# EAGLE design Detect-frelon_TONE3-1 (EAGLE 9.6.2)
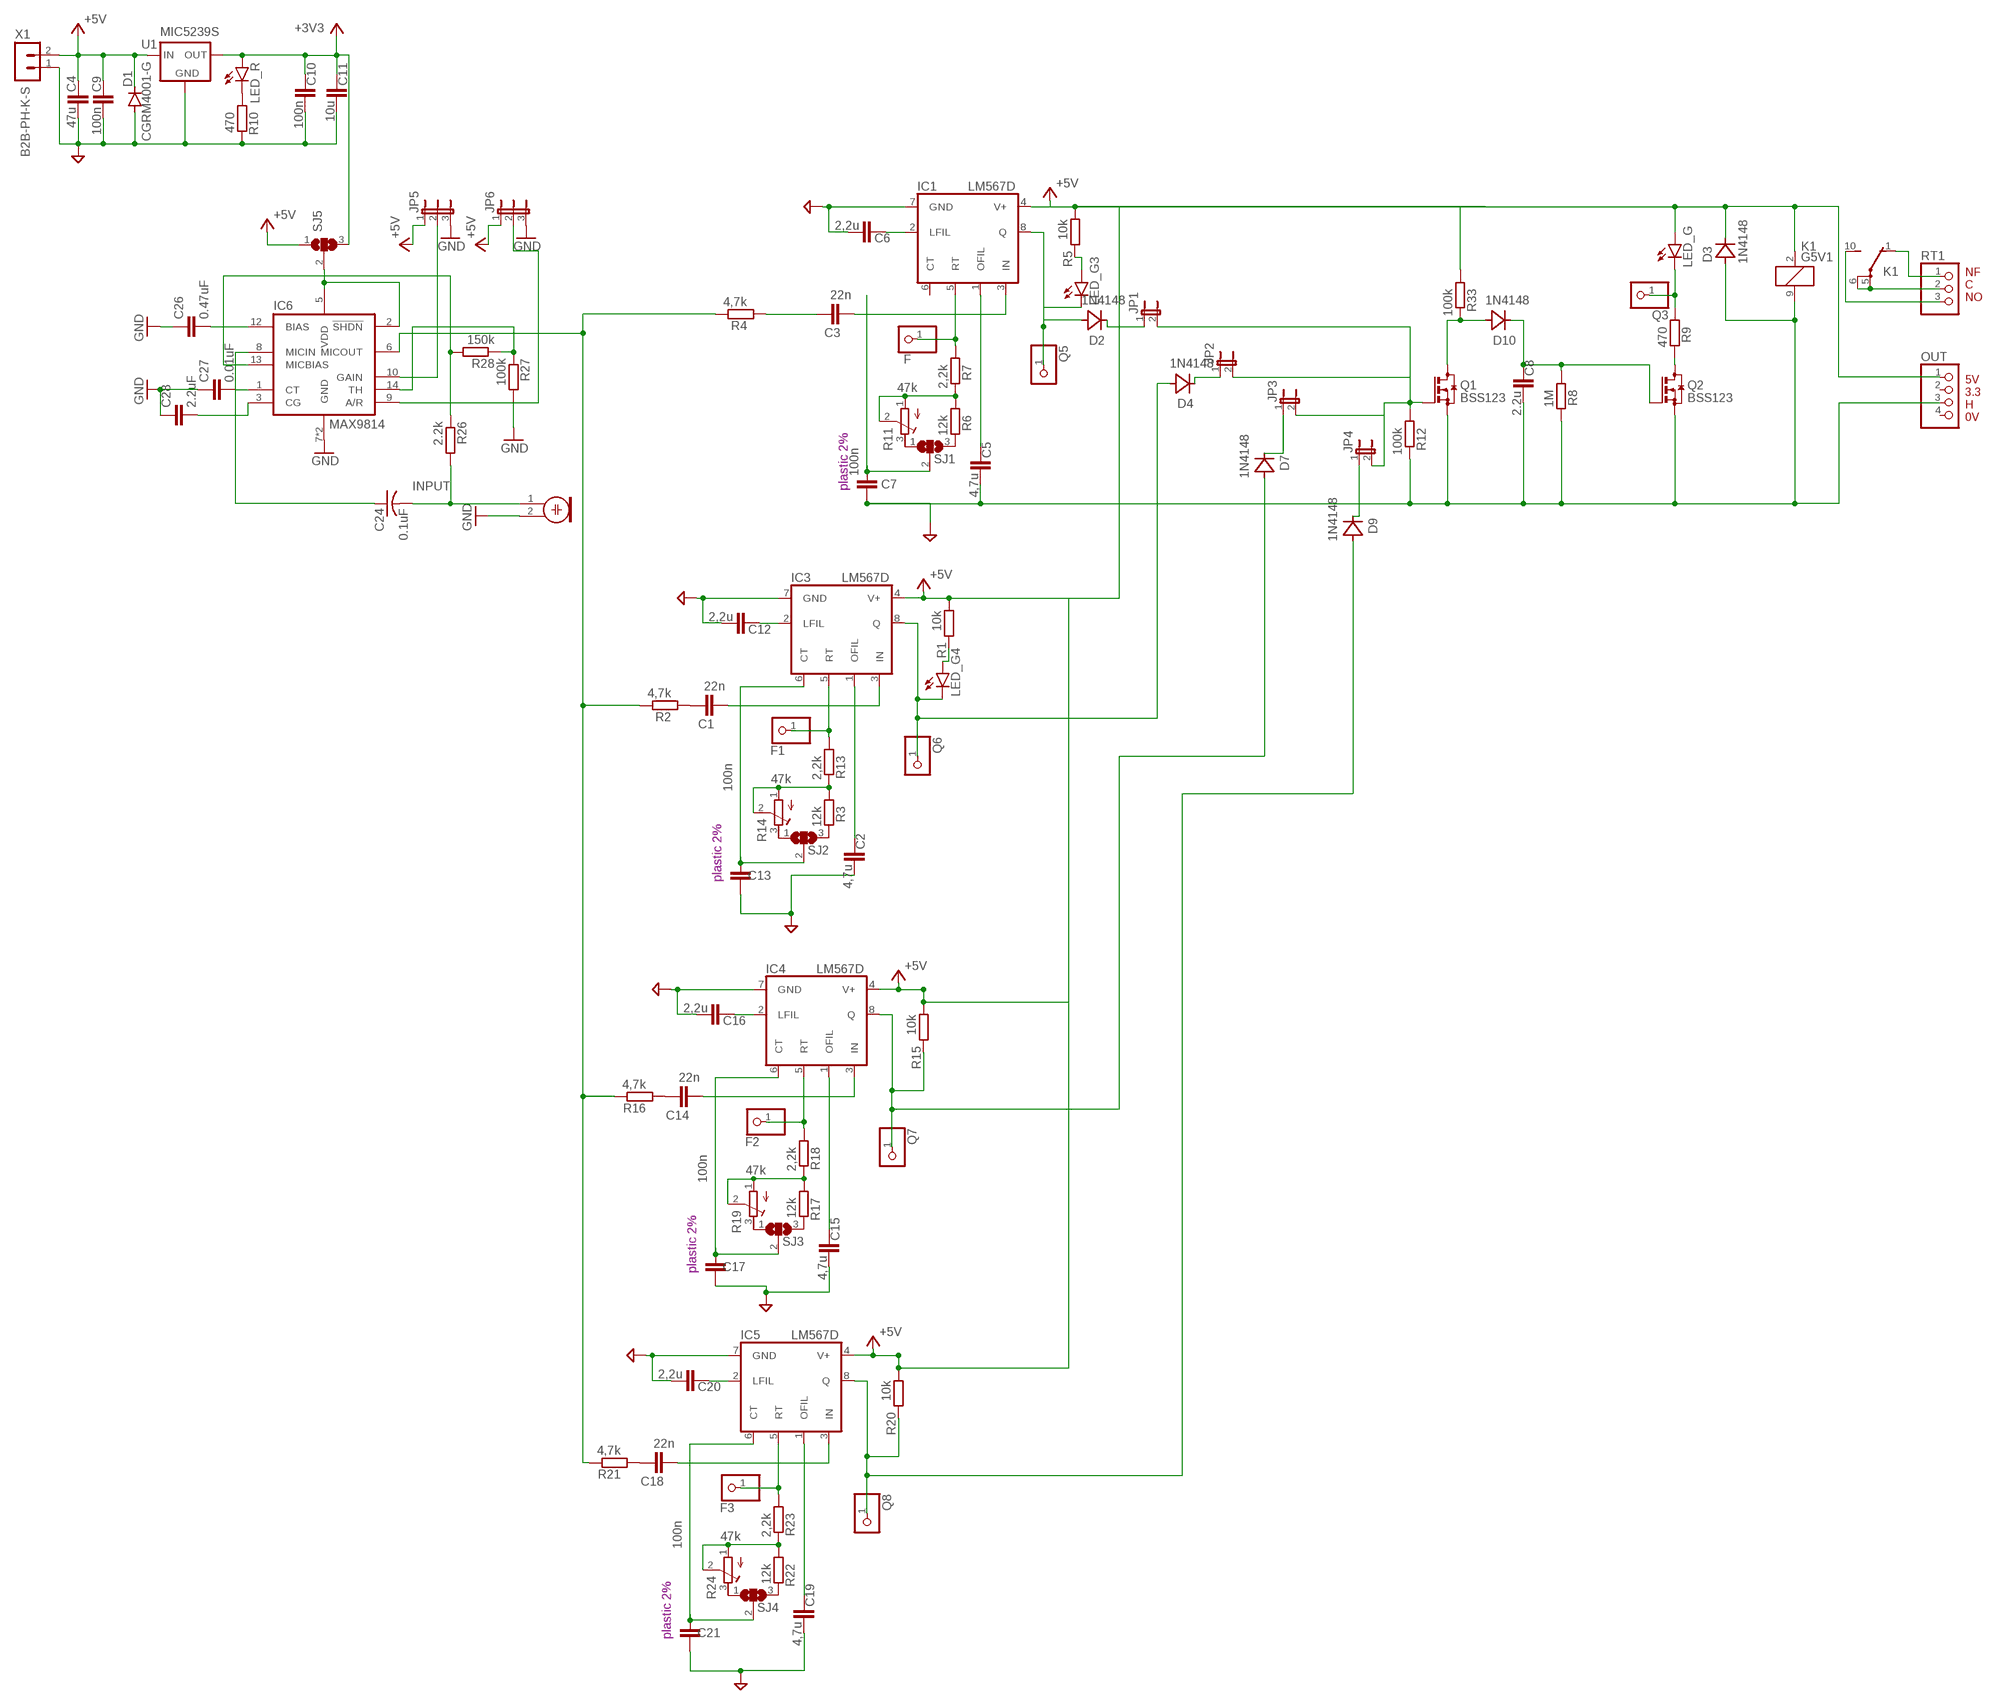
[diagram p0: schematic, sheet 1]

## Parts
C1  22n  CC1206  [C1206]
C2  4,7u  CC1206  [C1206]
C3  22n  CC1206  [C1206]
C4  47u  CC1210  [C1210]
C5  4,7u  CC1206  [C1206]
C6  2,2u  CC1206  [C1206]
C7  100n  CC1210  [C1210]
C8  2.2u  CC1210  [C1210]
C9  100n  CC1206  [C1206]
C10  100n  CC1206  [C1206]
C11  10u  CC1210  [C1210]
C12  2,2u  CC1206  [C1206]
C13  100n  CC1210  [C1210]
C14  22n  CC1206  [C1206]
C15  4,7u  CC1206  [C1206]
C16  2,2u  CC1206  [C1206]
C17  100n  CC1210  [C1210]
C18  22n  CC1206  [C1206]
C19  4,7u  CC1206  [C1206]
C20  2,2u  CC1206  [C1206]
C21  100n  CC1210  [C1210]
C24  0.1uF  C-USC0805K  [C0805K]
C26  0.47uF  C-EUC1206  [C1206]
C27  0.01uF  C-EUC1206  [C1206]
C28  2.2uF  C-EUC1206  [C1206]
D1  CGRM4001-G  [SOD-123_MINI-SMA]
D2  1N4148  [VISHAY_1N4148W-E3-08_0]
D3  1N4148  [VISHAY_1N4148W-E3-08_0]
D4  1N4148  [VISHAY_1N4148W-E3-08_0]
D7  1N4148  [VISHAY_1N4148W-E3-08_0]
D9  1N4148  [VISHAY_1N4148W-E3-08_0]
D10  1N4148  [VISHAY_1N4148W-E3-08_0]
F  PINHD-1X1  [1X01]
F1  PINHD-1X1  [1X01]
F2  PINHD-1X1  [1X01]
F3  PINHD-1X1  [1X01]
IC1  LM567D  [SO08]
IC3  LM567D  [SO08]
IC4  LM567D  [SO08]
IC5  LM567D  [SO08]
IC6  MAX9814  [TDFN14-EP]
JP1  JP1E  [JP1]
JP2  JP1E  [JP1]
JP3  JP1E  [JP1]
JP4  JP1E  [JP1]
JP5  JP2E  [JP2]
JP6  JP2E  [JP2]
K1  G5V1  [G5V1]
LED_G  LEDSMT1206  [1206]
LED_G3  LEDSMT1206  [1206]
LED_G4  LEDSMT1206  [1206]
LED_R  LEDSMT1206  [1206]
M2  ELECTRET_MICROPHON-WM-62PC/62PK  [WM-62PC/62PK]
OUT  PINHD-1X4  [1X04]
Q1  BSS123  [SOT23]
Q2  BSS123  [SOT23]
Q3  PINHD-1X1  [1X01]
Q5  PINHD-1X1  [1X01]
Q6  PINHD-1X1  [1X01]
Q7  PINHD-1X1  [1X01]
Q8  PINHD-1X1  [1X01]
R1  10k  RR1206  [R1206]
R2  4,7k  RR1206  [R1206]
R3  12k  RR1206  [R1206]
R4  4,7k  RR1206  [R1206]
R5  10k  RR1206  [R1206]
R6  12k  RR1206  [R1206]
R7  2,2k  RR1206  [R1206]
R8  1M  RR1206  [R1206]
R9  470  RR1206  [R1206]
R10  470  RR1206  [R1206]
R11  47k  R-TRIMM3296W  [RTRIM3296W]
R12  100k  RR1206  [R1206]
R13  2,2k  RR1206  [R1206]
R14  47k  R-TRIMM3296W  [RTRIM3296W]
R15  10k  RR1206  [R1206]
R16  4,7k  RR1206  [R1206]
R17  12k  RR1206  [R1206]
R18  2,2k  RR1206  [R1206]
R19  47k  R-TRIMM3296W  [RTRIM3296W]
R20  10k  RR1206  [R1206]
R21  4,7k  RR1206  [R1206]
R22  12k  RR1206  [R1206]
R23  2,2k  RR1206  [R1206]
R24  47k  R-TRIMM3296W  [RTRIM3296W]
R26  2.2k  R-EU_R1206  [R1206]
R27  100k  R-EU_R1206  [R1206]
R28  150k  R-EU_R1206  [R1206]
R33  100k  RR1206  [R1206]
RT1  PINHD-1X3  [1X03]
SJ1  SJ2W  [SJ_2]
SJ2  SJ2W  [SJ_2]
SJ3  SJ2W  [SJ_2]
SJ4  SJ2W  [SJ_2]
SJ5  SJ2W  [SJ_2]
U1  MIC5239S  [SOT223]
X1  B2B-PH-K-S  [B2B-PH-K-S]

## Nets
+3V3: C10.1 C11.1 LED_R.A SJ5.3 U1.3(OUT)
+5V: C4.1 C9.1 D1.C D3.1(C) IC1.4(V+) IC3.4(V+) IC4.4(V+) IC5.4(V+) JP5.1 JP6.1 K1.2 LED_G.A OUT.1 R1.1 R5.1 R15.1 R20.1 R33.1 SJ5.1 U1.1(IN) X1.2
GND: C2.2 C4.2 C5.2 C6.2 C7.2 C8.2 C9.2 C10.2 C11.2 C12.2 C13.2 C15.2 C16.2 C17.2 C19.2 C20.2 C21.2 C26.1 C27.1 C28.1 D1.A D3.2(A) IC1.7(GND) IC3.7(GND) IC4.7(GND) IC5.7(GND) IC6.7(GND) IC6.EP(GND) JP5.3 JP6.3 K1.9 M2.2 OUT.3 Q1.2(S) Q2.2(S) R8.2 R10.2 R12.2 R27.2 U1.2(GND) U1.4(GND) X1.1
INPUT: C24.2 M2.1 R26.2
N$1: C3.1 R4.1
N$2: F.1 IC1.5(RT) R7.1
N$4: IC6.10(GAIN) JP5.2
N$5: LED_R.C R10.1
N$7: C16.1 IC4.2(LFIL)
N$8: C8.1 D10.1(C) Q2.1(G) R8.1
N$9: C12.1 IC3.2(LFIL)
N$10: C2.1 IC3.1(OFIL)
N$11: C6.1 IC1.2(LFIL)
N$12: C5.1 IC1.1(OFIL)
N$13: R6.2 SJ1.3
N$14: Q2.3(D) R9.2
N$15: R6.1 R7.2 R11.1(A) R11.2(S)
N$16: D2.1(C) JP1.1
N$17: LED_G.C Q3.1 R9.1
N$18: C1.1 R2.1
N$19: K1.5(2:P) K1.6(2:P) RT1.2
N$20: C13.1 IC3.6(CT) SJ2.2
N$21: R11.3(E) SJ1.1
N$22: C7.1 SJ1.2
N$23: LED_G4.A R1.2
N$25: F1.1 IC3.5(RT) R13.1
N$28: R3.1 R13.2 R14.1(A) R14.2(S)
N$29: C3.2 IC1.3(IN)
N$30: D2.2(A) IC1.8(Q) LED_G3.C Q5.1
N$31: R3.2 SJ2.3
N$32: R14.3(E) SJ2.1
N$33: C1.2 IC3.3(IN)
N$34: D4.2(A) IC3.8(Q) LED_G4.C Q6.1
N$35: C15.1 IC4.1(OFIL)
N$36: C14.1 R16.1
N$37: C17.1 IC4.6(CT) SJ3.2
N$38: F2.1 IC4.5(RT) R18.1
N$39: R17.1 R18.2 R19.1(A) R19.2(S)
N$40: R17.2 SJ3.3
N$41: R19.3(E) SJ3.1
N$42: C14.2 IC4.3(IN)
N$43: D7.2(A) IC4.8(Q) Q7.1 R15.2
N$44: C27.2 IC6.1(CT)
N$45: C20.1 IC5.2(LFIL)
N$46: C19.1 IC5.1(OFIL)
N$47: C18.1 R21.1
N$48: C21.1 IC5.6(CT) SJ4.2
N$49: F3.1 IC5.5(RT) R23.1
N$50: R22.1 R23.2 R24.1(A) R24.2(S)
N$51: R22.2 SJ4.3
N$52: R24.3(E) SJ4.1
N$53: C18.2 IC5.3(IN)
N$54: D9.2(A) IC5.8(Q) Q8.1 R20.2
N$55: JP1.2 JP2.2 JP3.2 JP4.2 Q1.1(G) R12.1
N$56: C28.2 IC6.3(CG)
N$57: IC6.13(MICBIAS) R26.1 R28.2
N$58: C24.1 IC6.8(MICIN)
N$59: IC6.14(TH) R27.1 R28.1
N$60: C26.2 IC6.12(BIAS)
N$61: IC6.9(A/R) JP6.2
N$62: IC6.2(!SHDN) IC6.5(VDD) SJ5.2
N$63: IC6.6(MICOUT) R2.2 R4.2 R16.2 R21.2
N$70: LED_G3.A R5.2
N$71: D10.2(A) Q1.3(D) R33.2
N$72: D4.1(C) JP2.1
N$73: D7.1(C) JP3.1
N$74: D9.1(C) JP4.1
NF: K1.1(2:O) RT1.1
NO: K1.10(2:S) RT1.3
Unconnected: IC1.6(CT) OUT.2 OUT.4

## Notes on the sheet
- NF
  C
  NO
- 5V
  3.3
  H
  0V
- plastic 2%
- plastic 2%
- plastic 2%
- plastic 2%

## Library data of the parts
C1-C21 = eagle-ltspice:C: CAPACITOR, European symbol; SPICEMODEL: NONE; SPICEPREFIX: C
C24 = adafruit:C-US: CAPACITOR, American symbol
C26-C28 = rcl:C-EU: CAPACITOR, European symbol; SPICEPREFIX: C
D1 = diode:CGRM400*-G: Molded plasitc,JEDEC SOD-123/Mini SMA Source: Comchip CGRM4001-G.pdf
D2-D4 D7 D9 D10 = 1N4148W-E3-08:1N4148: Diode Standard 75V 150mA Surface Mount SOD-123
F F1-F3 Q3 Q5-Q8 = pinhead:PINHD-1X1: PIN HEADER
IC1 IC3-IC5 = linear:*567: TONE DECODER
IC6 = maximintergrated-max9814:MAX9814: he MAX9814 is a low-cost, high-quality microphone amplifier with automatic gain control (AGC) and low-noise microphone bias. The device features a low-noise preamplifier, variable gain amplifier (VGA), output amplifier, microphone-bias-voltage generator and AGC control circuitry. The library has been designed by Richard Magdycz <https://www.facebook.com/groups/eaglecadsoftUK>
JP1-JP4 = jumper:JP1E: JUMPER
JP5 JP6 = jumper:JP2E: JUMPER
K1 = relay:G5V1: RELAY 1 x switch, 0.5 A/125 V AC, 1 A/24 V DC , Omron; MPN: G5V-1-DC24; OC_FARNELL: 9949593; OC_NEWARK: 36M6377
LED_G LED_G3 LED_G4 LED_R = led:LED: LED OSRAM: - CHIPLED LG R971, LG N971, LY N971, LG Q971, LY Q971, LO R971, LY R971 LH N974, LH R974 LS Q976, LO Q976, LY Q976 LO Q996 - Hyper CHIPLED LW Q18S LB Q993, LB Q99A, LB R99A - SideLED LS A670, LO A670, LY A670, LG A670, LP A670 LB A673, LV A673, LT A673, LW A673 LH A674 LY A675 LS A676, LA A676, LO A676, LY A676, LW A676 LS A679, LY A679, LG A679 - Hyper Micro SIDELED® LS Y876, LA Y876, LO Y876, LY Y876 LT Y87S - SmartLED LW L88C, LW L88S LB L89C, LB L89S, LG L890 LS L89K, LO L89K, LY L89K LS L896, LA L896, LO L896, LY L896 - TOPLED LS T670, LO T670, LY T670, LG T670, LP T670 LSG T670, LSP T670, LSY T670, LOP T670, LYG T670 LG T671, LOG T671, LSG T671 LB T673, LV T673, LT T673, LW T673 LH T674 LS T676, LA T676, LO T676, LY T676, LB T676, LH T676, LSB T676, LW T676 LB T67C, LV T67C, LT T67C, LS T67K, LO T67K, LY T67K, LW E67C LS E67B, LA E67B, LO E67B, LY E67B, LB E67C, LV E67C, LT E67C LW T67C LS T679, LY T679, LG T679 LS T770, LO T770, LY T770, LG T770, LP T770 LB T773, LV T773, LT T773, LW T773 LH T774 LS E675, LA E675, LY E675, LS T675 LS T776, LA T776, LO T776, LY T776, LB T776 LHGB T686 LT T68C, LB T68C - Hyper Mini TOPLED® LB M676 - Mini TOPLED Santana® LG M470 LS M47K, LO M47K, LY M47K Source: http://www.osram.convergy.de LUXEON: - LUMILED® LXK2-PW12-R00, LXK2-PW12-S00, LXK2-PW14-U00, LXK2-PW14-V00 LXK2-PM12-R00, LXK2-PM12-S00, LXK2-PM14-U00 LXK2-PE12-Q00, LXK2-PE12-R00, LXK2-PE12-S00, LXK2-PE14-T00, LXK2-PE14-U00 LXK2-PB12-K00, LXK2-PB12-L00, LXK2-PB12-M00, LXK2-PB14-N00, LXK2-PB14-P00, LXK2-PB14-Q00 LXK2-PR12-L00, LXK2-PR12-M00, LXK2-PR14-Q00, LXK2-PR14-R00 LXK2-PD12-Q00, LXK2-PD12-R00, LXK2-PD12-S00 LXK2-PH12-R00, LXK2-PH12-S00 LXK2-PL12-P00, LXK2-PL12-Q00, LXK2-PL12-R00 Source: www.luxeon.com KINGBRIGHT: KA-3528ASYC Source: www.kingbright.com
M2 = microphon:ELECTRET_MICROPHON-: Electret Condenser Microphone
OUT = pinhead:PINHD-1X4: PIN HEADER
Q1 Q2 = transistor-small-signal:BSS123: N-CHANNEL MOS FET
R1-R10 R12 R13 R15-R18 R20-R23 R33 = eagle-ltspice:R: RESISTOR, European symbol; SPICEMODEL: NONE; SPICEPREFIX: R
R11 R14 R19 R24 = rcl:R-TRIMM: Trimm resistor; SPICEMODEL: X; SPICEPREFIXL: POT
R26-R28 = rcl:R-EU_: RESISTOR, European symbol; SPICEPREFIX: R
RT1 = pinhead:PINHD-1X3: PIN HEADER
SJ1-SJ5 = jumper:SJ2W: SMD solder JUMPER
U1 = micrel:MIC5239S: LDO REGULATOR
X1 = con-JST PH:B2B-PH: JST PH series header 2.00mm pitch disconnectable crimp style connectors, vertical (side entry type), 2 pins

## Board
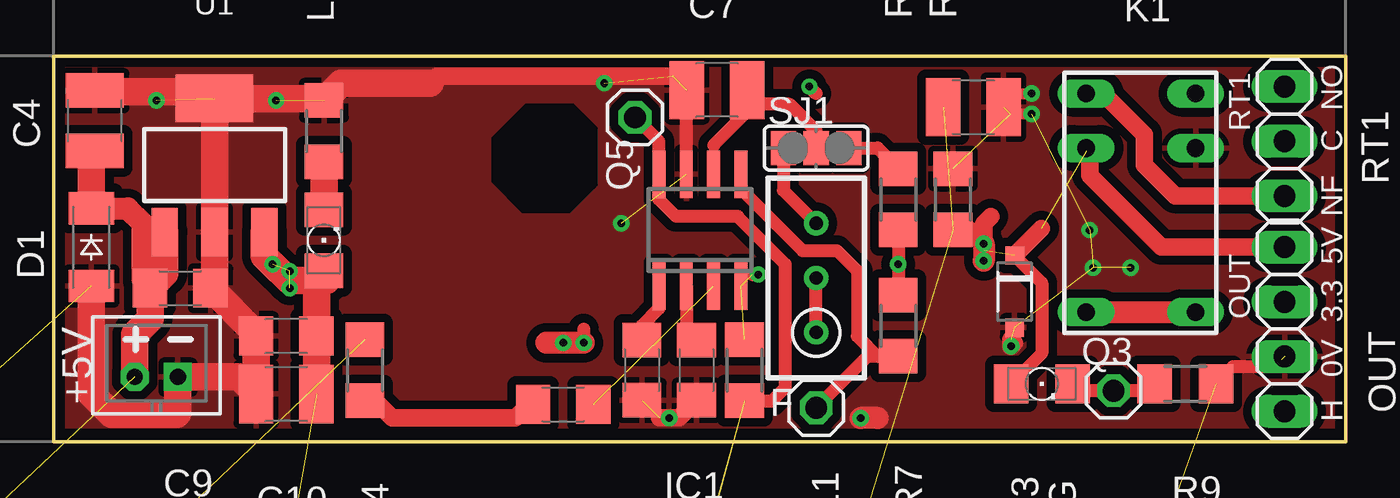
[diagram p1: board, top side]
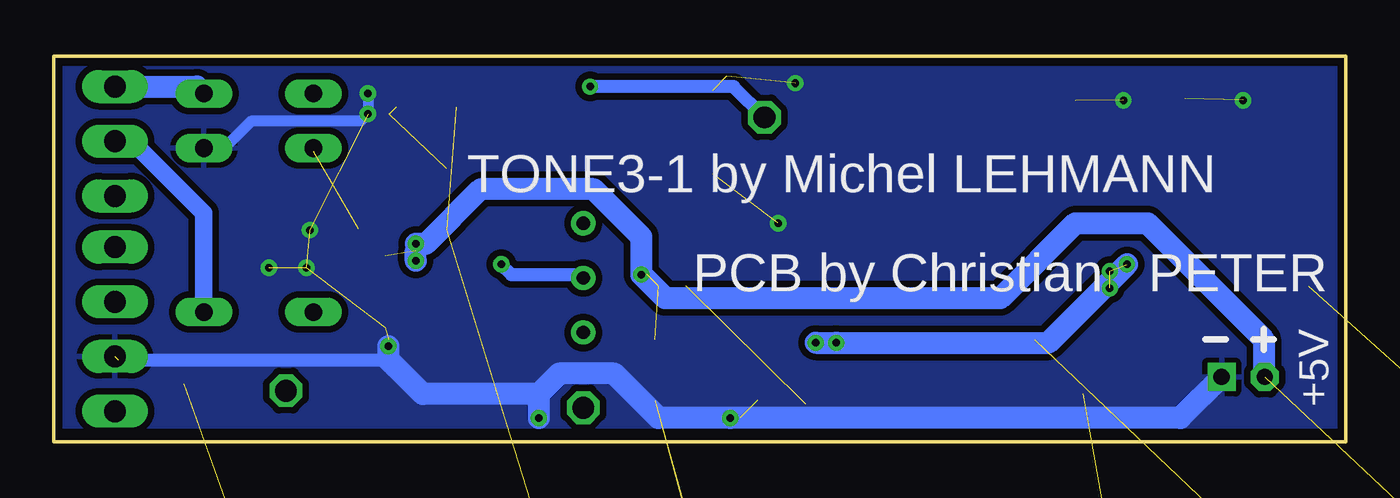
[diagram p2: board, bottom side, seen from below]

Size 59.99 x 17.93 mm. Coordinates in mm from the lower left corner, seen from the top.
Outline: 0,0 59.99,0 59.99,17.93 0,17.93 0,0
Copper layers (1*16): Top 0.035mm / dielectric 1.5mm / Bottom 0.035mm
Design rules "default *": minimum track width 6mil, minimum drill 0.35mm, track to track 6mil, track to pad 6mil, pad to pad 6mil, via to via 6mil, smd to smd 6mil, copper to edge 6mil, drill to drill 6mil, minimum pad ring 10mil, minimum via ring 8mil, stop-mask expansion 4mil, vias tented up to drill 0mil, thermal gap 10mil

### Footprints (pad centres in the part's own frame; a part is rotated, then mirrored left to right if it is on the bottom)
C1206 = smd 1.6 x 1.8: 1 -1.4,0; 2 1.4,0
C1210 = smd 1.6 x 2.7: 1 -1.4,0; 2 1.4,0
C0805K = smd 1.1 x 1.4: 1 -1,0; 2 1,0
SOD-123_MINI-SMA = smd 1.5 x 2.1: A 1.8,0; C -1.8,0
VISHAY_1N4148W-E3-08_0 = smd 0.85 x 0.85: 1 -1.675,0; 2 1.675,0
1X01 = drill 1.016 octagon: 1 0,0
SO08 = smd 0.6 x 2.2: 1 -1.905,-2.6; 2 -0.635,-2.6; 3 0.635,-2.6; 4 1.905,-2.6; 5 1.905,2.6; 6 0.635,2.6; 7 -0.635,2.6; 8 -1.905,2.6
TDFN14-EP = smd 0.25 x 0.7: 1 -1.2,-1.5; 2 -0.8,-1.5; 3 -0.4,-1.5; 4 0,-1.5; 5 0.4,-1.5; 6 0.8,-1.5; 7 1.2,-1.5; 8 1.2,1.5; 9 0.8,1.5; 10 0.4,1.5; 11 0,1.5; 12 -0.4,1.5; 13 -0.8,1.5; 14 -1.2,1.5 | smd 2.4 x 1.8: EP 0,0
JP1 = drill 0.914 long: 1 0,-1.27; 2 0,1.27
JP2 = drill 0.914 long: 1 -2.54,0; 2 0,0; 3 2.54,0
G5V1 = drill 0.813 long: 1 -5.08,-2.54; 2 -2.54,-2.54; 5 5.08,-2.54; 6 5.08,2.54; 9 -2.54,2.54; 10 -5.08,2.54
1206 = smd 1.6 x 1.803: A -1.422,0; C 1.422,0
WM-62PC/62PK = drill 0.6 pad 1: 1 -1,0.95; 2 -1,-0.95
1X04 = drill 1.016 long: 1 -3.81,0; 2 -1.27,0; 3 1.27,0; 4 3.81,0
SOT23 = smd 1 x 1.4: 1 -0.95,-1.1; 2 0.95,-1.1; 3 0,1.1
R1206 = smd 1.6 x 1.803: 1 -1.422,0; 2 1.422,0
RTRIM3296W = drill 0.61: 1 0,-2.54; 2 0,0; 3 0,2.54
1X03 = drill 1.016 long: 1 -2.54,0; 2 0,0; 3 2.54,0
SJ_2 = smd 1.168 x 1.6: 1 -1.524,0; 2 0,0; 3 1.524,0
SOT223 = smd 1.219 x 2.235: 1 -2.311,-3.099; 2 0,-3.099; 3 2.311,-3.099 | smd 3.6 x 2.2: 4 0,3.099
B2B-PH-K-S = drill 0.75 pad 1.3 square: 1 1,0 | drill 0.75 pad 1.3 octagon: 2 -1,0

### Placement (x,y rotation side)
C1  -36.35,-39.85 0 top  (outside the outline)
C2  -36.51,-32.38 0 top  (outside the outline)
C3  23.65,1.75 0 top
C4  1.91,14.92 90 top
C5  27.3,3.33 270 top
C6  29.84,3.33 270 top
C7  30.8,16.35 180 top
C8  42.7,15.56 0 top
C9  5.87,7.14 0 top
C10  10.79,4.92 180 top
C11  10.79,2.22 180 top
C12  -31.27,-32.38 0 top  (outside the outline)
C13  -41.59,-33.02 0 top  (outside the outline)
C14  -36.35,-68.58 0 top  (outside the outline)
C15  -36.51,-61.12 0 top  (outside the outline)
C16  -31.27,-61.12 0 top  (outside the outline)
C17  -41.59,-61.75 0 top  (outside the outline)
C18  -36.35,-97.31 0 top  (outside the outline)
C19  -36.51,-89.85 0 top  (outside the outline)
C20  -31.27,-89.85 0 top  (outside the outline)
C21  -41.59,-90.49 0 top  (outside the outline)
C24  -36.04,-164.15 0 top  (outside the outline)
C26  -41.59,-193.36 0 top  (outside the outline)
C27  -49.53,-216.06 0 top  (outside the outline)
C28  -49.53,-222.25 0 top  (outside the outline)
D1  1.75,9.05 270 top
D2  -49.53,-316.39 0 top  (outside the outline)
D3  44.61,6.99 270 top
D4  -49.53,-320.2 0 top  (outside the outline)
D7  -49.53,-324.01 0 top  (outside the outline)
D9  -49.53,-327.82 0 top  (outside the outline)
D10  -49.53,-331.63 0 top  (outside the outline)
F  35.4,1.59 0 top
F1  -38.73,-46.67 0 top  (outside the outline)
F2  -38.73,-75.41 0 top  (outside the outline)
F3  -38.73,-104.14 0 top  (outside the outline)
IC1  30,9.84 0 top
IC3  -30.48,-24.77 0 top  (outside the outline)
IC4  -30.48,-53.5 0 top  (outside the outline)
IC5  -30.48,-82.23 0 top  (outside the outline)
IC6  -42.07,-130.49 0 top  (outside the outline)
JP1  -18.89,-16.03 0 top  (outside the outline)
JP2  -25.88,-16.03 0 top  (outside the outline)
JP3  -32.86,-16.03 0 top  (outside the outline)
JP4  -40.64,-15.24 0 top  (outside the outline)
JP5  -48.1,-193.68 0 top  (outside the outline)
JP6  -48.1,-228.92 0 top  (outside the outline)
K1  50.48,11.11 270 top
LED_G  45.88,2.7 0 top
LED_G3  -49.69,-296.07 0 top  (outside the outline)
LED_G4  -49.69,-300.2 0 top  (outside the outline)
LED_R  12.54,9.37 90 top
M2  -40.8,-176.53 0 top  (outside the outline)
OUT  57.15,5.24 270 top
Q1  -49.69,-281.78 0 top  (outside the outline)
Q2  -49.69,-289.24 0 top  (outside the outline)
Q3  49.21,2.38 0 top
Q5  26.99,15.08 0 top
Q6  -42.23,-46.67 0 top  (outside the outline)
Q7  -42.23,-75.41 0 top  (outside the outline)
Q8  -42.23,-104.14 0 top  (outside the outline)
R1  -31.27,-39.85 0 top  (outside the outline)
R2  -26.04,-32.38 0 top  (outside the outline)
R3  -26.19,-39.85 0 top  (outside the outline)
R4  14.45,3.33 90 top
R5  32.07,3.33 270 top
R6  39.21,11.27 90 top
R7  39.21,5.4 90 top
R8  41.75,11.27 90 top
R9  52.55,2.7 0 top
R10  12.54,14.45 90 top
R11  35.4,7.62 0 top
R12  -49.53,-304.32 0 top  (outside the outline)
R13  -41.59,-39.85 0 top  (outside the outline)
R14  -39.53,-24.13 0 top  (outside the outline)
R15  -31.27,-68.58 0 top  (outside the outline)
R16  -26.04,-61.12 0 top  (outside the outline)
R17  -26.19,-68.58 0 top  (outside the outline)
R18  -41.59,-68.58 0 top  (outside the outline)
R19  -39.53,-52.86 0 top  (outside the outline)
R20  -31.27,-97.31 0 top  (outside the outline)
R21  -26.04,-89.85 0 top  (outside the outline)
R22  -26.19,-97.31 0 top  (outside the outline)
R23  -41.59,-97.31 0 top  (outside the outline)
R24  -39.53,-81.6 0 top  (outside the outline)
R26  -49.53,-209.87 0 top  (outside the outline)
R27  -49.53,-203.68 0 top  (outside the outline)
R28  -41.59,-197.49 0 top  (outside the outline)
R33  -49.53,-310.51 0 top  (outside the outline)
RT1  57.15,13.97 90 top
SJ1  35.4,13.65 0 top
SJ2  -34.45,-46.04 0 top  (outside the outline)
SJ3  -34.45,-74.77 0 top  (outside the outline)
SJ4  -34.45,-103.5 0 top  (outside the outline)
SJ5  -49.21,-335.76 0 top  (outside the outline)
U1  7.46,12.86 0 top
X1  4.76,3.02 0 top

### Tracks (layer width: path | path; a pad name or v marks a point on that pad's centre or on a via)
+3V3  (via drill 0.35)  (3 unrouted)
  Top 0.61: 24.61,5.25 v24.61,4.6
  Top 1.016: v24.61,4.6 22.86,4.6
  Top 1.27: C11.1 C10.1 12.2,7.5 | LED_R.A 12.67,7.81 12.67,7.5 12.2,7.5 | U1.3 9.77,8.64 v10.16,8.26 10.92,7.5 12.2,7.5
  Bottom 1.016: v10.16,8.26 13.81,4.6 v23.65,4.6 v24.61,4.6
  other vias: 10.95,7.94 10.95,7.14
+5V  (via drill 0.35)  (14 unrouted)
  Top 0.61: v32.7,7.78 32.45,7.78 | D3.1 45.88,7.39 45.88,4.12 LED_G.A
  Top 0.813: 43.51,10.48 43.18,10.15 v43.18,9.21 42.54,9.85 | 47.94,13.51 K1.2 48.1,13.49 48.1,12.38 51.44,9.05 OUT.1 | 45.87,9.92 D3.1
  Top 1.016: D1.C 3.44,10.85 4.13,10.16 4.13,7.49 C9.1 | v43.18,9.21 v43.18,8.41
  Top 1.27: X1.2 3.76,5 4.47,5.71 C9.1 5.15,7.82 U1.1 | D1.C 1.75,13.36 C4.1
  Bottom 1.016: X1.2 3.81,3.06 3.81,4.76 9.21,10.16 12.54,10.16 16.03,6.67 31.59,6.67 v32.7,7.78 32.7,9.53 34.92,11.75 40.16,11.75 42.7,9.21 v43.18,9.21 | v43.18,8.41 43.18,8.89
GND  (via drill 0.35)  (39 unrouted)
  Top 0.508: 44.74,16.19 v45.4,16.19 | v45.4,15.24 44.42,15.24
  Top 0.61: IC1.7 29.37,16.35 | OUT.3 56.67,3.49 54.76,3.49
  Top 0.813: 44.61,4.6 v44.45,4.45 44.45,4.76 44.44,4.77 | 28.13,1.11 v28.57,1.11 29.02,1.11 C6.2 | 17.47,16.66 17.79,16.99 28.76,16.99
  Top 1.016: 38.27,1.11 v37.47,1.11
  Top 1.27: U1.4 U1.2 7.46,7.33 C9.2 9.39,5.02 C10.2 C11.2 8.6,3.02 X1.1 5.76,1.32 5.71,1.27 2.7,1.27 1.75,2.22 D1.A | U1.4 7.14,16.27 1.95,16.27 C4.2 | U1.4 12.45,15.96 R10.2 13.34,16.66 17.47,16.66
  Bottom 0.508: v45.4,16.19 v45.4,15.24 45.72,14.92 50.8,14.92 52.07,13.65 K1.9
  Bottom 0.61: 56.99,3.81 44.45,3.81
  Bottom 1.016: X1.1 7.67,1.11 v28.57,1.11 31.91,1.11 33.97,3.17 36.51,3.17 37.47,2.22 | v44.45,4.45 44.45,3.81 42.86,2.22 37.47,2.22 | v37.47,1.11 37.47,2.22
  other vias: 48.26,8.1 50.01,8.1 48.1,9.84 10.32,15.88 4.76,15.88 25.56,16.67 26.35,10.16
  pour Bottom (isolate 0.305): 0.32,17.45 0.32,0.64 59.67,0.64 59.67,17.45
  pour Top (isolate 0.406): 0.32,17.45 0.32,0.64 59.83,0.64 59.83,17.45
  cutout Top: 20.32,14.13 21.91,15.72 24.13,15.72 25.24,14.61 25.24,11.91 23.97,10.64 21.75,10.64 20.32,12.06
INPUT  (2 unrouted)
N$1
  Top 0.813: R4.1 14.92,1.91 15.72,1.11 21.43,1.11 22.07,1.75 C3.1
N$2
  Top 0.61: IC1.5 31.91,11.75 34.77,8.89 36.35,8.89 37.31,7.94 37.31,4.92 38.25,3.98 R7.1 37.79,3.98 F.1
N$4  (1 unrouted)
N$5
  Top 1.27: LED_R.C R10.1
N$7  (1 unrouted)
N$8  (3 unrouted)
N$9  (1 unrouted)
N$10  (1 unrouted)
N$11
  Top 0.61: IC1.2 29.37,5.21 C6.1
N$12
  Top 0.61: IC1.1 28.1,6.19 27.3,5.4 C5.1
N$13
  Top 0.61: SJ1.3 38.25,13.65 R6.2
N$14  (1 unrouted)
N$15  (via drill 0.35)
  Top 0.61: R6.1 v39.21,8.26 R7.2 | R11.1 R11.2
  Bottom 0.61: R11.2 35.56,7.78 38.73,7.78 v39.21,8.26
N$16  (1 unrouted)
N$17
  Top 0.61: R9.1 50.81,2.38 Q3.1 47.62,2.38 LED_G.C
N$18  (1 unrouted)
N$19
  Top 1.016: K1.5 K1.6
  Bottom 0.813: 57.15,13.81 RT1.2 56.83,13.65 56.04,13.65 53.02,10.64 K1.6
N$20  (2 unrouted)
N$21
  Top 0.61: SJ1.1 33.88,11.68 R11.3
N$22
  Top 0.61: 30.64,13.78 32.54,15.69 32.86,15.69 | 32.86,15.69 C7.1 | 32.86,15.69 34.16,15.69 35.4,14.45 SJ1.2
N$23  (1 unrouted)
N$25  (2 unrouted)
N$28  (3 unrouted)
N$29  (1 unrouted)
N$30  (via drill 0.35)  (2 unrouted)
  Top 0.61: 32.07,1.91 33.34,1.91 33.97,2.54 33.97,8.26 31.75,10.48 28.89,10.48 28.1,11.27 IC1.8 28.1,13.97 Q5.1 | v35.08,16.51 35.4,16.19
  Bottom 0.61: Q5.1 28.42,16.51 v35.08,16.51
N$31  (1 unrouted)
N$32  (1 unrouted)
N$33  (1 unrouted)
N$34  (3 unrouted)
N$35  (1 unrouted)
N$36  (1 unrouted)
N$37  (2 unrouted)
N$38  (2 unrouted)
N$39  (3 unrouted)
N$40  (1 unrouted)
N$41  (1 unrouted)
N$42  (1 unrouted)
N$43  (3 unrouted)
N$44  (1 unrouted)
N$45  (1 unrouted)
N$46  (1 unrouted)
N$47  (1 unrouted)
N$48  (2 unrouted)
N$49  (2 unrouted)
N$50  (3 unrouted)
N$51  (1 unrouted)
N$52  (1 unrouted)
N$53  (1 unrouted)
N$54  (3 unrouted)
N$55  (5 unrouted)
N$56  (1 unrouted)
N$57  (2 unrouted)
N$58  (1 unrouted)
N$59  (2 unrouted)
N$60  (1 unrouted)
N$61  (1 unrouted)
N$62  (2 unrouted)
N$63  (4 unrouted)
N$70  (1 unrouted)
N$71  (2 unrouted)
N$72  (1 unrouted)
N$73  (1 unrouted)
N$74  (1 unrouted)
NF
  Top 0.813: RT1.1 52.07,11.43 50.64,12.86 50.64,14.29 48.74,16.19 K1.1
NO
  Bottom 1.016: RT1.3 53.34,16.51 K1.10

### Text on the board
tNames: NO | RT1 | C | NF | 5V | OUT | 3.3 | 0V | +5V | H
bNames: TONE3-1 by Michel LEHMANN | PCB by Christian PETER | +5V